# Altium schematic sheet AnalogueIO.SchDoc
size A4
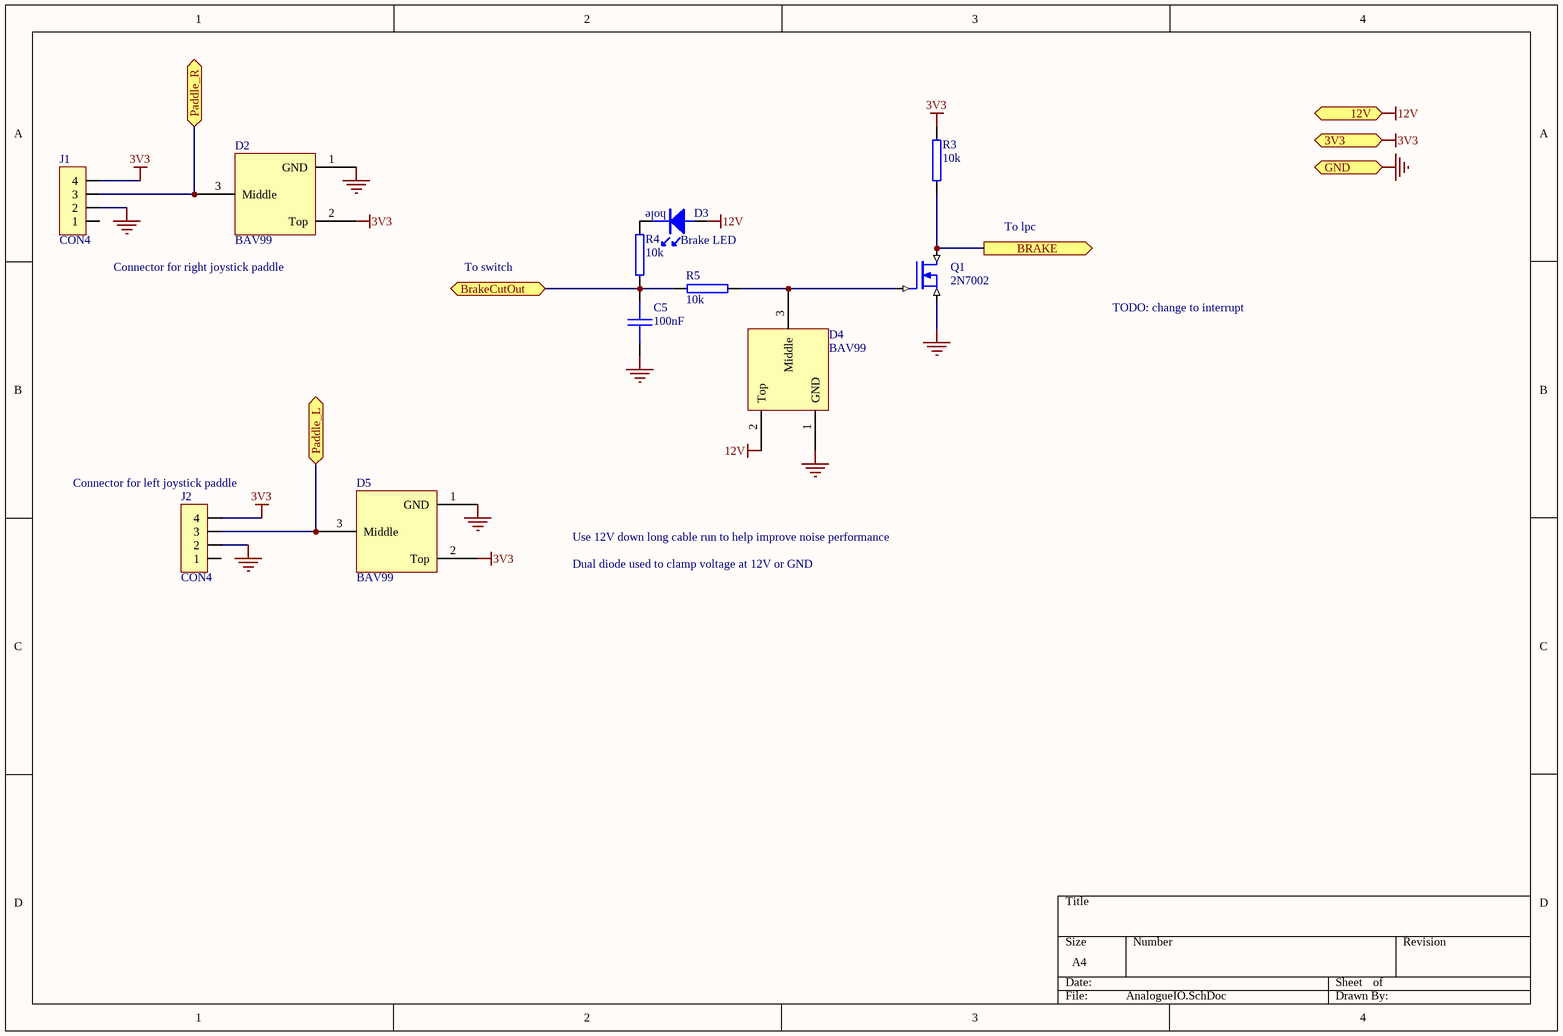
[diagram p0: AnalogueIO.SchDoc]

## Parts
C5  100nF  [0603]
D2  BAV99  [dual  diode]
D3  Brake LED  [3mm LED]
D4  BAV99  [dual  diode]
D5  BAV99  [dual  diode]
J1  CON4  [MICROFIT-4-VERT]
J2  CON4  [MICROFIT-4-VERT]
Q1  2N7002  [SOT23-3]
R3  10k  [0603]
R4  10k  [0603]
R5  10k  [0603]

## Ports
3V3 (in), 12V (in), BRAKE (out), BrakeCutOut, GND, Paddle_L, Paddle_R

## Nets
3V3: D2.2(Top) D5.2(Top) J1.4 J2.4 R3.2 ; port 3V3
12V: D3.A D4.2(Top) ; port 12V
GND: C5.2 D2.1(GND) D4.1(GND) D5.1(GND) J1.2 J2.2 Q1.S ; port GND
BRAKE: Q1.D R3.1 ; port BRAKE
BrakeCutOut: C5.1 R4.2 R5.1 ; port BrakeCutOut
Paddle_L: D5.3(Middle) J2.3 ; port Paddle_L
Paddle_R: D2.3(Middle) J1.3 ; port Paddle_R
NetD3_K: D3.K R4.1
NetD4_3: D4.3(Middle) Q1.G R5.2

Not connected (* = marked no-connect by the designer): J1 1; J2 1

## Notes on the sheet
- To lpc
- Connector for right joystick paddle
- To switch
- TODO: change to interrupt
- (near J2) Connector for left joystick paddle
- Use 12V down long cable run to help improve noise performance
- Dual diode used to clamp voltage at 12V or GND
- (in symbol LED_HOLE) hole

## Library data of the parts
C5 = CAP: Capacitor; Value: 0.1uF; Revision: July-2002: Re-released for DXP Platform.; Farnell: 753-567; Price: 0.31
D2 D4 D5 = BAV99: Dual Diode
D3 = LED_HOLE: through hole LED
J1 J2 = CON4: Connector; element14: http://au.element14.com/molex/43045-0412/header-vertical-4way/dp/1012247
Q1 = N-MOSFET: pin to pad: D>3 G>1 S>2; Farnell: 518-402; Price: 0.62
R3-R5 = RES: Standard Resistor; Farnell: 612-601; Price: 0.11; Value: 10k